# Altium project BRCM_V1.PrjPcb
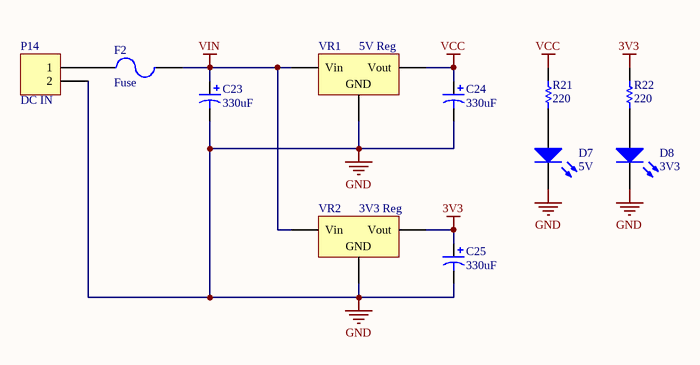
[diagram p0: Votage Reguator.SchDoc]
5 sheets, 84 parts. Net scope: global (net labels, ports and power ports of the same name join across sheets).
Sheets:
  Votage Reguator.SchDoc
  BRCM_V1.SchDoc
  DXL Bus.SchDoc
  IMU Sensor.SchDoc
  USB To Serial.SchDoc

## Sheet Votage Reguator.SchDoc
size A4

### Parts
C23  330uF  [SV-C]
C24  330uF  [SV-C]
C25  330uF  [SV-C]
D7  5V  [CHIPLED_0603]
D8  3V3  [CHIPLED_0603]
F2  Fuse  [FUSE-HOLDER-SMD]
P14  DC IN  [DEANS]
R21  220  [0603-RES]
R22  220  [0603-RES]
VR1  5V Reg  [OKI-78SRH]
VR2  3V3 Reg  [OKI-78SRH]

### Nets
3V3: C25.1 R22.2 VR2.3(Vout)
GND: C23.2 C24.2 C25.2 D7.2(K) D8.2(K) P14.2 VR1.2(GND) VR2.2(GND)
VCC: C24.1 R21.2 VR1.3(Vout)
VIN: C23.1 F2.2 VR1.1(Vin) VR2.1(Vin)
NetD7_1: D7.1(A) R21.1
NetD8_1: D8.1(A) R22.1
NetF2_1: F2.1 P14.1

### Library data of the parts
C23-C25 = Cap Pol: Polarized Capacitor (Axial); Published: 8-Jun-2000; LatestRevisionDate: 17-Jul-2002; LatestRevisionNote: Re-released for DXP Platform.; PackageReference: POLAR0.8; Publisher: Altium Limited; PackageDescription: Polarized Capacitor; 2 Leads; Value: 330uF
D7 D8 = LED: Typical INFRARED GaAs LED; Published: 8-Jun-2000; LatestRevisionDate: 08-Jul-2005; LatestRevisionNote: Mech Layer 1 removed.; PackageReference: LED-0; Publisher: Altium Limited; PackageDescription: LED; 2 Leads
P14 = Header 2: Header, 2-Pin; LatestRevisionDate: 17-Jul-2002; LatestRevisionNote: Re-released for DXP Platform.; Publisher: Altium Limited
R21 R22 = Res: Resistor; Published: 8-Jun-2000; LatestRevisionDate: 17-Jul-2002; LatestRevisionNote: Re-released for DXP Platform.; PackageReference: AXIAL-0.3; Publisher: Altium Limited; PackageDescription: Axial Device, Thru-Hole; 2 Leads; 0.3 in Pin Spacing; Value: 220
VR1 VR2 = Volt Reg: Voltage Regulator; Published: 24-Mar-1999; LatestRevisionDate: 29-May-2009; LatestRevisionNote: IPC-7351 Footprint Added.; PackageReference: D2PAK; Publisher: Altium Limited; PackageDescription: 3-Pin Transistor Outline Package 2.54 mm Pitch, 15.1 mm Lead Span
F2 = Fuse: Published: 8-Jun-2000; LatestRevisionDate: 17-Jul-2002; LatestRevisionNote: Re-released for DXP Platform.; PackageReference: PIN-W2/E2.8; Publisher: Altium Limited; PackageDescription: Thru-Hole; 2 Leads

## Sheet BRCM_V1.SchDoc
size A4
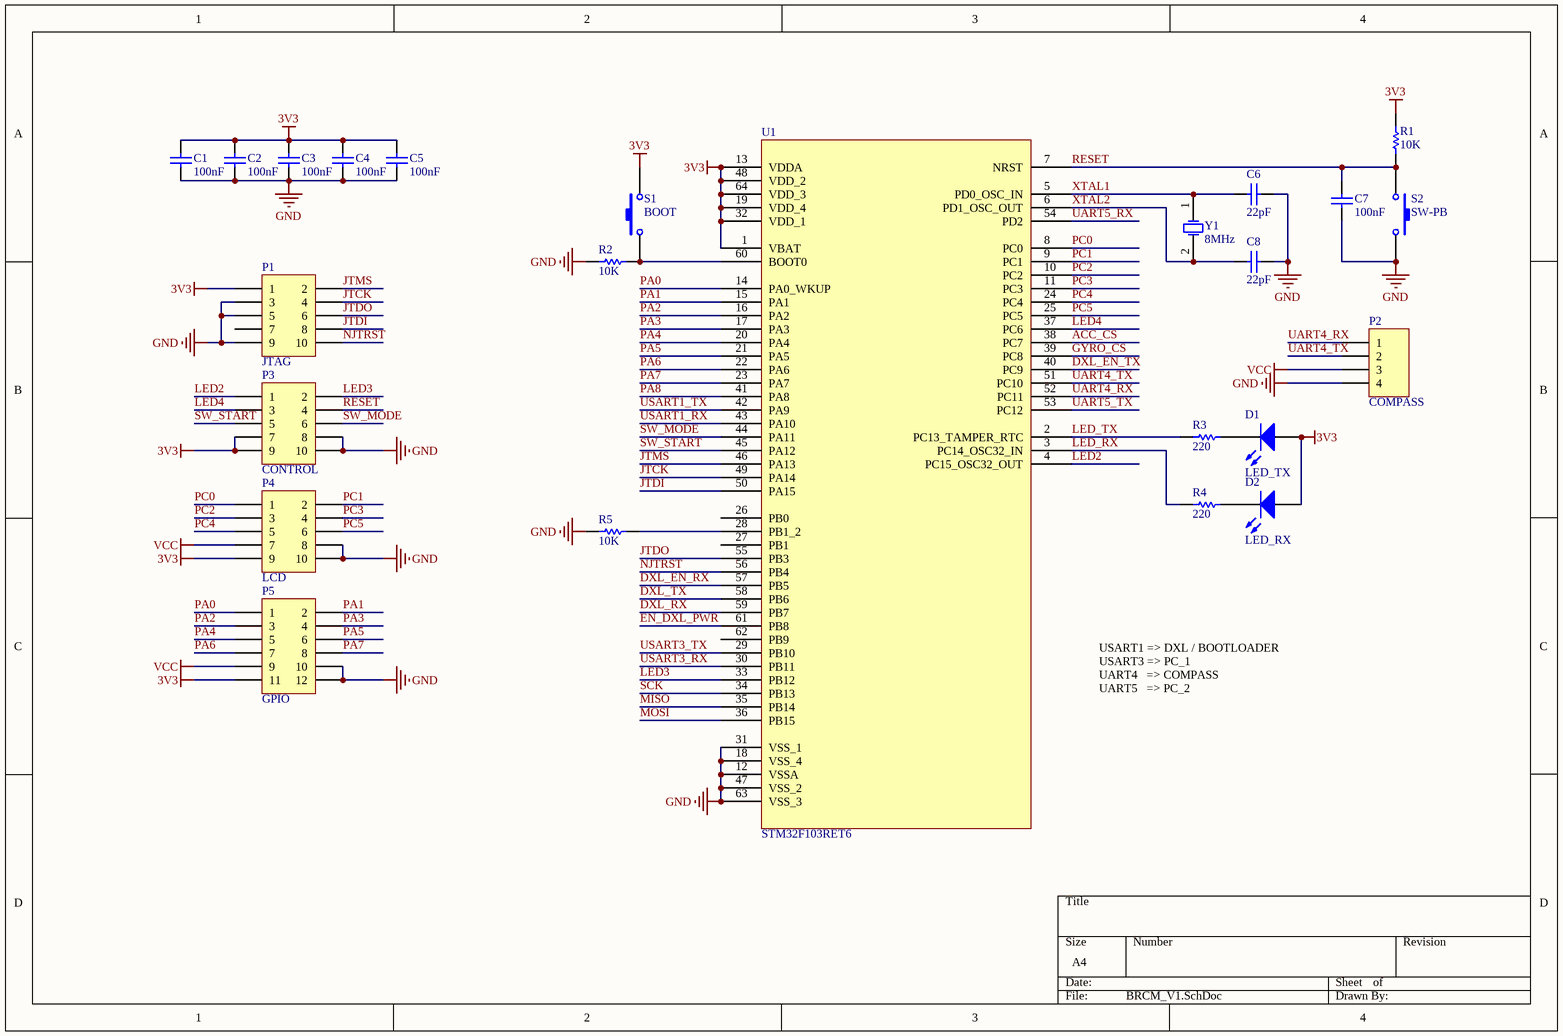
[diagram p1: BRCM_V1.SchDoc]

### Parts
C1  100nF  [0603-CAP]
C2  100nF  [0603-CAP]
C3  100nF  [0603-CAP]
C4  100nF  [0603-CAP]
C5  100nF  [0603-CAP]
C6  22pF  [0603-CAP]
C7  100nF  [0603-CAP]
C8  22pF  [0603-CAP]
D1  LED_TX  [CHIPLED_0603]
D2  LED_RX  [CHIPLED_0603]
P1  JTAG  [HDR2X5]
P2  COMPASS  [HDR1X4]
P3  CONTROL  [HDR2X5]
P4  LCD  [HDR2X5]
P5  GPIO  [HDR2X6]
R1  10K  [0603-RES]
R2  10K  [0603-RES]
R3  220  [0603-RES]
R4  220  [0603-RES]
R5  10K  [0603-RES]
S1  BOOT  [TACTILE-SWITCH-SMD]
S2  SW-PB  [TACTILE-SWITCH-SMD]
U1  STM32F103RET6  [QFP-64N]
Y1  8MHz  [HC49UP]

### Nets
3V3: C1.2 C2.2 C3.2 C4.2 C5.2 D1.1(A) D2.1(A) P1.1 P3.7 P3.9 P4.9 P5.11 R1.2 S1.3 U1.1(VBAT) U1.13(VDDA) U1.19(VDD_4) U1.32(VDD_1) U1.48(VDD_2) U1.64(VDD_3)
GND: C1.1 C2.1 C3.1 C4.1 C5.1 C6.1 C7.1 C8.1 P1.3 P1.5 P1.9 P2.4 P3.8 P3.10 P4.8 P4.10 P5.10 P5.12 R2.1 R5.1 S2.3 U1.12(VSSA) U1.18(VSS_4) U1.31(VSS_1) U1.47(VSS_2) U1.63(VSS_3)
VCC: P2.3 P4.7 P5.9
ACC_CS: U1.38(PC7)
DXL_EN_RX: U1.57(PB5)
DXL_EN_TX: U1.40(PC9)
DXL_RX: U1.59(PB7)
DXL_TX: U1.58(PB6)
EN_DXL_PWR: U1.61(PB8)
GYRO_CS: U1.39(PC8)
JTCK: P1.4 U1.49(PA14)
JTDI: P1.8 U1.50(PA15)
JTDO: P1.6 U1.55(PB3)
JTMS: P1.2 U1.46(PA13)
LED2: P3.1 U1.4(PC15_OSC32_OUT)
LED3: P3.2 U1.33(PB12)
LED4: P3.3 U1.37(PC6)
LED_RX: R4.1 U1.3(PC14_OSC32_IN)
LED_TX: R3.1 U1.2(PC13_TAMPER_RTC)
MISO: U1.35(PB14)
MOSI: U1.36(PB15)
NJTRST: P1.10 U1.56(PB4)
PA0: P5.1 U1.14(PA0_WKUP)
PA1: P5.2 U1.15(PA1)
PA2: P5.3 U1.16(PA2)
PA3: P5.4 U1.17(PA3)
PA4: P5.5 U1.20(PA4)
PA5: P5.6 U1.21(PA5)
PA6: P5.7 U1.22(PA6)
PA7: P5.8 U1.23(PA7)
PA8: U1.41(PA8)
PC0: P4.1 U1.8(PC0)
PC1: P4.2 U1.9(PC1)
PC2: P4.3 U1.10(PC2)
PC3: P4.4 U1.11(PC3)
PC4: P4.5 U1.24(PC4)
PC5: P4.6 U1.25(PC5)
RESET: C7.2 P3.4 R1.1 S2.1 U1.7(NRST)
SCK: U1.34(PB13)
SW_MODE: P3.6 U1.44(PA11)
SW_START: P3.5 U1.45(PA12)
UART4_RX: P2.1 U1.52(PC11)
UART4_TX: P2.2 U1.51(PC10)
UART5_RX: U1.54(PD2)
UART5_TX: U1.53(PC12)
USART1_RX: U1.43(PA10)
USART1_TX: U1.42(PA9)
USART3_RX: U1.30(PB11)
USART3_TX: U1.29(PB10)
XTAL1: C6.2 U1.5(PD0_OSC_IN) Y1.1(OSC1)
XTAL2: C8.2 U1.6(PD1_OSC_OUT) Y1.2(OSC2)
NetD1_2: D1.2(K) R3.2
NetD2_2: D2.2(K) R4.2
NetR2_2: R2.2 S1.1 U1.60(BOOT0)
NetR5_2: R5.2 U1.28(PB1_2)

Not connected (* = marked no-connect by the designer): P1 7; U1 26(PB0) 27(PB1) 62(PB9)

### Notes on the sheet
- USART1 => DXL / BOOTLOADER
  USART3 => PC_1
  UART4   => COMPASS
  UART5   => PC_2

### Library data of the parts
C1-C8 = Cap: Capacitor; Published: 8-Jun-2000; LatestRevisionDate: 17-Jul-2002; LatestRevisionNote: Re-released for DXP Platform.; PackageReference: RAD-0.3; Publisher: Altium Limited; PackageDescription: Radial Cap, Thru-Hole; 2 Leads; 0.3 in Pin Spacing
  C1-C5 C7: Value: 100nF
  C6 C8: Value: 22pF
D1 D2 = LED: Typical INFRARED GaAs LED; Published: 8-Jun-2000; LatestRevisionDate: 08-Jul-2005; LatestRevisionNote: Mech Layer 1 removed.; PackageReference: LED-0; Publisher: Altium Limited; PackageDescription: LED; 2 Leads
P1 P3 P4 = Header 5X2: Header, 5-Pin, Dual row; LatestRevisionDate: 17-Jul-2002; LatestRevisionNote: Re-released for DXP Platform.; Publisher: Altium Limited
P2 = Header 4: Header, 4-Pin; LatestRevisionDate: 17-Jul-2002; LatestRevisionNote: Re-released for DXP Platform.; Publisher: Altium Limited
P5 = Header 6X2: Header, 6-Pin, Dual row; LatestRevisionDate: 17-Jul-2002; LatestRevisionNote: Re-released for DXP Platform.; Publisher: Altium Limited
R1-R5 = Res: Resistor; Published: 8-Jun-2000; LatestRevisionDate: 17-Jul-2002; LatestRevisionNote: Re-released for DXP Platform.; PackageReference: AXIAL-0.3; Publisher: Altium Limited; PackageDescription: Axial Device, Thru-Hole; 2 Leads; 0.3 in Pin Spacing
  R1 R2 R5: Value: 10K
  R3 R4: Value: 220
S1 S2 = SW-PB: Switch; Published: 24-Mar-1999; LatestRevisionDate: 17-Jul-2002; LatestRevisionNote: Re-released for DXP Platform.; PackageReference: SPST-2; Publisher: Altium Limited; PackageDescription: Switch; 2 Leads
Y1 = XTAL: Crystal Oscillator; Published: 8-Jun-2000; LatestRevisionDate: 17-Jul-2002; LatestRevisionNote: Re-released for DXP Platform.; PackageReference: R38; Publisher: Altium Limited; PackageDescription: Crystal, Thru-Hole; 2 Leads; Body 3.1 x 8.2 mm (Dia.xH)
U1 = STM32F103RET6: MPN: STM32F103RET6; OC_FARNELL: 1624138; OC_NEWARK: 01P4101; PACKAGE: QFP-64; SUPPLIER: STMICROELECTRONICS

## Sheet DXL Bus.SchDoc
size A4; DrawnBy: Eko Rudiawan
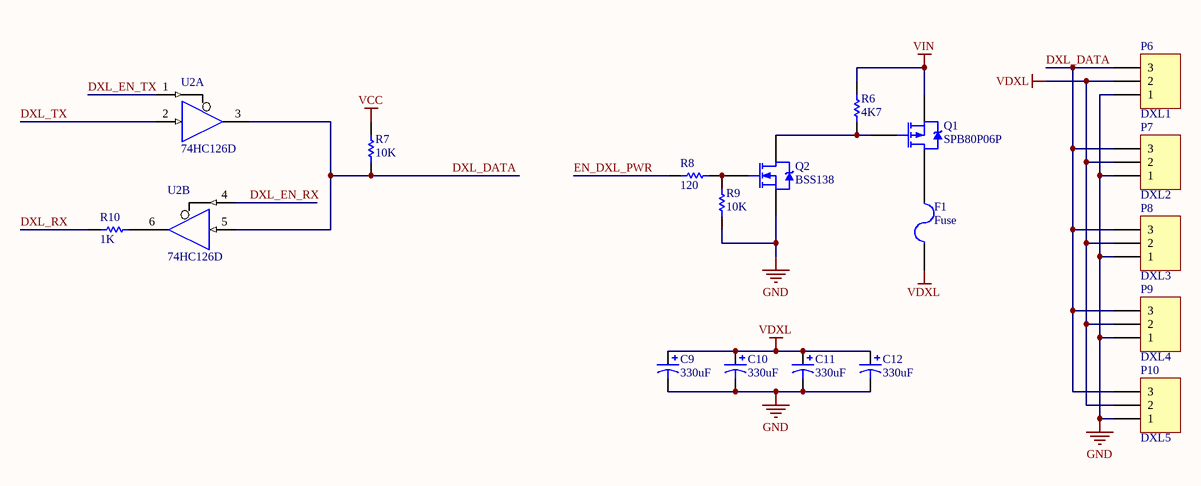
[diagram p2: DXL Bus.SchDoc]

### Parts
C9  330uF  [SV-C]
C10  330uF  [SV-C]
C11  330uF  [SV-C]
C12  330uF  [SV-C]
F1  Fuse  [FUSE-HOLDER-SMD]
P6  DXL1  [DXL]
P7  DXL2  [DXL]
P8  DXL3  [DXL]
P9  DXL4  [DXL]
P10  DXL5  [DXL]
Q1  SPB80P06P  [TO263]
Q2  BSS138  [SOT23]
R6  4K7  [0603-RES]
R7  10K  [0603-RES]
R8  120  [0603-RES]
R9  10K  [0603-RES]
R10  1K  [0603-RES]
U2  74HC126D  [14-SOIC]  (parts A,B of 4)

### Nets
GND: C9.2 C10.2 C11.2 C12.2 P6.1 P7.1 P8.1 P9.1 P10.1 Q2.2(S) R9.1 U2.7(GND)
VCC: R7.2 U2.14(VCC)
VDXL: C9.1 C10.1 C11.1 C12.1 F1.1 P6.2 P7.2 P8.2 P9.2 P10.2
VIN: Q1.3(S) R6.2
DXL_DATA: P6.3 P7.3 P8.3 P9.3 P10.3 R7.1 U2.3(Y) U2.5(A)
DXL_EN_RX: U2.4(OE)
DXL_EN_TX: U2.1(OE)
DXL_RX: R10.1
DXL_TX: U2.2(A)
EN_DXL_PWR: R8.1
NetF1_2: F1.2 Q1.2(D)
NetQ1_1: Q1.1(G) Q2.3(D) R6.1
NetQ2_1: Q2.1(G) R8.2 R9.2
NetR10_2: R10.2 U2.6(Y)

### Library data of the parts
C9-C12 = Cap Pol: Polarized Capacitor (Axial); Published: 8-Jun-2000; LatestRevisionDate: 17-Jul-2002; LatestRevisionNote: Re-released for DXP Platform.; PackageReference: POLAR0.8; Publisher: Altium Limited; PackageDescription: Polarized Capacitor; 2 Leads; Value: 330uF
P6-P10 = Header 3: Header, 3-Pin; LatestRevisionDate: 17-Jul-2002; LatestRevisionNote: Re-released for DXP Platform.; Publisher: Altium Limited
Q1 = PMOS: P-Channel Power MOSFET; Note: Pin 4 not drawn and electrically connected to Pin 2.; Published: 8-Jun-2000; LatestRevisionDate: 17-Jul-2002; LatestRevisionNote: Re-released for DXP Platform.; DatasheetVersion: PD-9.390D; PackageVersion: Feb-1997; PackageReference: TO-220AB; Publisher: Altium Limited; PackageDescription: TO, Thru-Hole, Vertical, Heatsink Mounted; 3 In-Line Leads; Pitch 2.54 mm; ComponentLink1Description: Manufacturer Link; ComponentLink1URL: http://www.irf.com/
Q2 = NMOS: N-Channel Power MOSFET; Note: Pin 2 is electrically connected to pin 4.; Published: 8-Jun-2000; LatestRevisionDate: 17-Jul-2002; LatestRevisionNote: Re-released for DXP Platform.; DatasheetVersion: PD-9.814; PackageVersion: Feb-1997; PackageReference: TO-220AB; Publisher: Altium Limited; PackageDescription: TO, Thru-Hole, Vertical, Heatsink Mounted; 3 In-Line Leads; Pitch 2.54 mm; ComponentLink1Description: Manufacturer Link; ComponentLink1URL: http://www.irf.com/
R6-R10 = Res: Resistor; Published: 8-Jun-2000; LatestRevisionDate: 17-Jul-2002; LatestRevisionNote: Re-released for DXP Platform.; PackageReference: AXIAL-0.3; Publisher: Altium Limited; PackageDescription: Axial Device, Thru-Hole; 2 Leads; 0.3 in Pin Spacing
  R6: Value: 4K7
  R7 R9: Value: 10K
  R8: Value: 120
  R10: Value: 1K
U2 = 74HC126D: Quadruple Bus Buffer Gate with 3-State Outputs; Published: 8-Jun-2000; LatestRevisionDate: 13-Apr-2006; LatestRevisionNote: IPC-7351 Footprint Added.; DatasheetVersion: Oct-1998; PackageVersion: Jan-1998; PackageReference: D014; Publisher: Altium Limited; PackageDescription: 14-Pin Small Outline Integrated Circuit 1.27 mm Pitch; Code_IPC: SOIC127P600-14; ComponentLink1Description: Manufacturer Link; ComponentLink1URL: http://www.ti.com/; ComponentLink2Description: Datasheet; ComponentLink2URL: http://www-s.ti.com/sc/ds/sn74ahct126.pdf
F1 = Fuse: Published: 8-Jun-2000; LatestRevisionDate: 17-Jul-2002; LatestRevisionNote: Re-released for DXP Platform.; PackageReference: PIN-W2/E2.8; Publisher: Altium Limited; PackageDescription: Thru-Hole; 2 Leads

## Sheet IMU Sensor.SchDoc
size A4
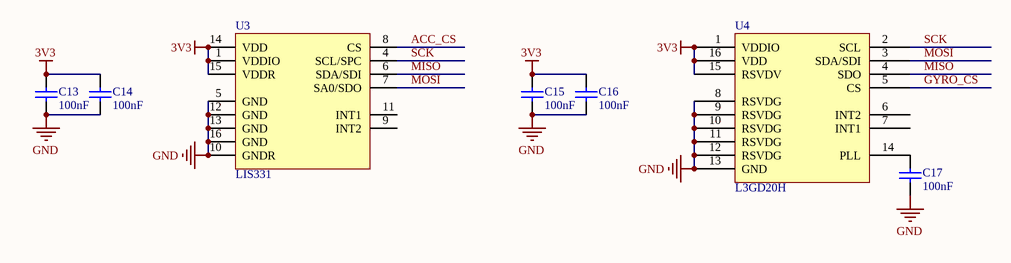
[diagram p3: IMU Sensor.SchDoc]

### Parts
C13  100nF  [0603-CAP]
C14  100nF  [0603-CAP]
C15  100nF  [0603-CAP]
C16  100nF  [0603-CAP]
C17  100nF  [0603-CAP]
U3  LIS331  [LGA16-3MM]
U4  L3GD20H  [LGA16-3MM]

### Nets
3V3: C13.2 C14.2 C15.2 C16.2 U3.1(VDDIO) U3.14(VDD) U3.15(VDDR) U4.1(VDDIO) U4.15(RSVDV) U4.16(VDD)
GND: C13.1 C14.1 C15.1 C16.1 C17.1 U3.5(GND) U3.10(GNDR) U3.12(GND) U3.13(GND) U3.16(GND) U4.8(RSVDG) U4.9(RSVDG) U4.10(RSVDG) U4.11(RSVDG) U4.12(RSVDG) U4.13(GND)
ACC_CS: U3.8(CS)
GYRO_CS: U4.5(CS)
MISO: U3.6(SDA/SDI) U4.4(SDO)
MOSI: U3.7(SA0/SDO) U4.3(SDA/SDI)
SCK: U3.4(SCL/SPC) U4.2(SCL)
NetC17_2: C17.2 U4.14(PLL)

Not connected (* = marked no-connect by the designer): U3 9(INT2) 11(INT1); U4 6(INT2) 7(INT1)

### Library data of the parts
C13-C17 = Cap: Capacitor; Published: 8-Jun-2000; LatestRevisionDate: 17-Jul-2002; LatestRevisionNote: Re-released for DXP Platform.; PackageReference: RAD-0.3; Publisher: Altium Limited; PackageDescription: Radial Cap, Thru-Hole; 2 Leads; 0.3 in Pin Spacing; Value: 100nF

## Sheet USB To Serial.SchDoc
size A4
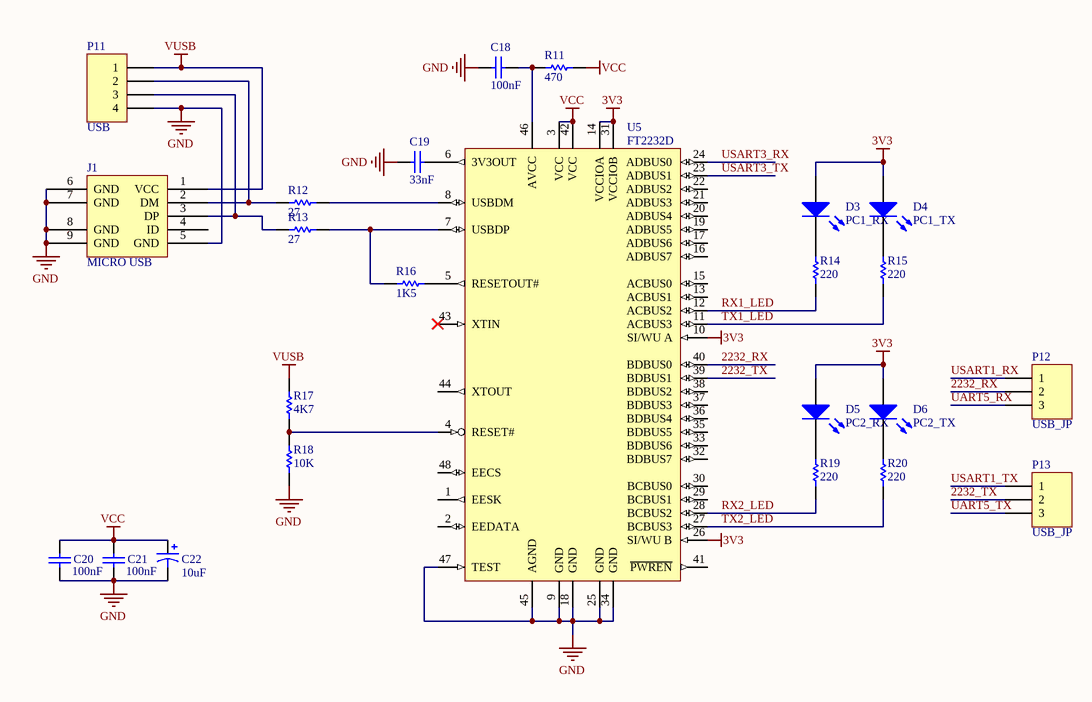
[diagram p4: USB To Serial.SchDoc]

### Parts
C18  100nF  [0603-CAP]
C19  33nF  [0603-CAP]
C20  100nF  [0603-CAP]
C21  100nF  [0603-CAP]
C22  10uF  [SV-C]
D3  PC1_RX  [CHIPLED_0603]
D4  PC1_TX  [CHIPLED_0603]
D5  PC2_RX  [CHIPLED_0603]
D6  PC2_TX  [CHIPLED_0603]
J1  MICRO USB  [USB_MICRO]
P11  USB  [HDR1X4]
P12  USB_JP  [HDR1X3]
P13  USB_JP  [HDR1X3]
R11  470  [0603-RES]
R12  27  [0603-RES]
R13  27  [0603-RES]
R14  220  [0603-RES]
R15  220  [0603-RES]
R16  1K5  [0603-RES]
R17  4K7  [0603-RES]
R18  10K  [0603-RES]
R19  220  [0603-RES]
R20  220  [0603-RES]
U5  FT2232D  [QFP-48N]

### Nets
3V3: D3.1(A) D4.1(A) D5.1(A) D6.1(A) U5.10(SI/WU_A) U5.14(VCCIOA) U5.26(SI/WU_B) U5.31(VCCIOB)
GND: C18.1 C19.1 C20.1 C21.1 C22.2 J1.5(GND) J1.6(GND) J1.7(GND) J1.8(GND) J1.9(GND) P11.4 R18.1 U5.9(GND) U5.18(GND) U5.25(GND) U5.34(GND) U5.45(AGND) U5.47(TEST)
VCC: C20.2 C21.2 C22.1 R11.2 U5.3(VCC) U5.42(VCC)
VUSB: J1.1(VCC) P11.1 R17.2
2232_RX: P12.2 U5.40(BDBUS0)
2232_TX: P13.2 U5.39(BDBUS1)
RX1_LED: R14.1 U5.12(ACBUS2)
RX2_LED: R19.1 U5.28(BCBUS2)
TX1_LED: R15.1 U5.11(ACBUS3)
TX2_LED: R20.1 U5.27(BCBUS3)
UART5_RX: P12.3
UART5_TX: P13.3
USART1_RX: P12.1
USART1_TX: P13.1
USART3_RX: U5.24(ADBUS0)
USART3_TX: U5.23(ADBUS1)
NetC18_2: C18.2 R11.1 U5.46(AVCC)
NetC19_2: C19.2 U5.6(3V3OUT)
NetD3_2: D3.2(K) R14.2
NetD4_2: D4.2(K) R15.2
NetD5_2: D5.2(K) R19.2
NetD6_2: D6.2(K) R20.2
NetJ1_2: J1.2(DM) P11.2 R12.1
NetJ1_3: J1.3(DP) P11.3 R13.1
NetR12_2: R12.2 U5.8(USBDM)
NetR13_2: R13.2 R16.1 U5.7(USBDP)
NetR16_2: R16.2 U5.5(RESETOUT#)
NetR17_1: R17.1 R18.2 U5.4(RESET#)

Not connected (* = marked no-connect by the designer): J1 4(ID); U5 1(EESK) 2(EEDATA) 13(ACBUS1) 15(ACBUS0) 16(ADBUS7) 17(ADBUS6) 19(ADBUS5) 20(ADBUS4) 21(ADBUS3) 22(ADBUS2) 29(BCBUS1) 30(BCBUS0) 32(BDBUS7) 33(BDBUS6) 35(BDBUS5) 36(BDBUS4) 37(BDBUS3) 38(BDBUS2) 41(~{PWREN}) 43(XTIN)* 44(XTOUT) 48(EECS)

### Library data of the parts
C18-C21 = Cap: Capacitor; Published: 8-Jun-2000; LatestRevisionDate: 17-Jul-2002; LatestRevisionNote: Re-released for DXP Platform.; PackageReference: RAD-0.3; Publisher: Altium Limited; PackageDescription: Radial Cap, Thru-Hole; 2 Leads; 0.3 in Pin Spacing
  C18 C20 C21: Value: 100nF
  C19: Value: 33nF
C22 = Cap Pol: Polarized Capacitor (Axial); Published: 8-Jun-2000; LatestRevisionDate: 17-Jul-2002; LatestRevisionNote: Re-released for DXP Platform.; PackageReference: POLAR0.8; Publisher: Altium Limited; PackageDescription: Polarized Capacitor; 2 Leads; Value: 10uF
D3-D6 = LED: Typical INFRARED GaAs LED; Published: 8-Jun-2000; LatestRevisionDate: 08-Jul-2005; LatestRevisionNote: Mech Layer 1 removed.; PackageReference: LED-0; Publisher: Altium Limited; PackageDescription: LED; 2 Leads
P11 = Header 4: Header, 4-Pin; LatestRevisionDate: 17-Jul-2002; LatestRevisionNote: Re-released for DXP Platform.; Publisher: Altium Limited
P12 P13 = Header 3: Header, 3-Pin; LatestRevisionDate: 17-Jul-2002; LatestRevisionNote: Re-released for DXP Platform.; Publisher: Altium Limited
R11-R20 = Res: Resistor; Published: 8-Jun-2000; LatestRevisionDate: 17-Jul-2002; LatestRevisionNote: Re-released for DXP Platform.; PackageReference: AXIAL-0.3; Publisher: Altium Limited; PackageDescription: Axial Device, Thru-Hole; 2 Leads; 0.3 in Pin Spacing
  R11: Value: 470
  R12 R13: Value: 27
  R14 R15 R19 R20: Value: 220
  R16: Value: 1K5
  R17: Value: 4K7
  R18: Value: 10K
U5 = FT2232D: Dual USB UART/FIFO Chip, LQFP-48; Published: 19-Aug-2010; DatasheetVersion: ver 2.03, May-2010; PackageVersion: 2005; PackageReference: LQFP-48; Publisher: Altium Limited; PackageDescription: 48-Pin Thin Quad Flat Pack 0.5 mm Pitch; ComponentLink1Description: Manufacturer Link; ComponentLink1URL: http://www.ftdichip.com/Products/ICs/FT2232D.htm; ComponentLink2Description: Datasheet; ComponentLink2URL: http://www.ftdichip.com/Support/Documents/DataSheets/ICs/DS_FT2232D.pdf

## Nets that join several sheets
3V3: Votage Reguator (C25.1 R22.2 VR2.3), BRCM_V1 (20 pins), IMU Sensor (10 pins), USB To Serial (8 pins)
GND: Votage Reguator (8 pins), BRCM_V1 (26 pins), DXL Bus (12 pins), IMU Sensor (16 pins), USB To Serial (18 pins)
VCC: Votage Reguator (C24.1 R21.2 VR1.3), BRCM_V1 (P2.3 P4.7 P5.9), DXL Bus (R7.2 U2.14), USB To Serial (6 pins)
VIN: Votage Reguator (C23.1 F2.2 VR1.1 VR2.1), DXL Bus (Q1.3 R6.2)
ACC_CS: BRCM_V1 (U1.38), IMU Sensor (U3.8)
DXL_EN_RX: BRCM_V1 (U1.57), DXL Bus (U2.4)
DXL_EN_TX: BRCM_V1 (U1.40), DXL Bus (U2.1)
DXL_RX: BRCM_V1 (U1.59), DXL Bus (R10.1)
DXL_TX: BRCM_V1 (U1.58), DXL Bus (U2.2)
EN_DXL_PWR: BRCM_V1 (U1.61), DXL Bus (R8.1)
GYRO_CS: BRCM_V1 (U1.39), IMU Sensor (U4.5)
MISO: BRCM_V1 (U1.35), IMU Sensor (U3.6 U4.4)
MOSI: BRCM_V1 (U1.36), IMU Sensor (U3.7 U4.3)
SCK: BRCM_V1 (U1.34), IMU Sensor (U3.4 U4.2)
UART5_RX: BRCM_V1 (U1.54), USB To Serial (P12.3)
UART5_TX: BRCM_V1 (U1.53), USB To Serial (P13.3)
USART1_RX: BRCM_V1 (U1.43), USB To Serial (P12.1)
USART1_TX: BRCM_V1 (U1.42), USB To Serial (P13.1)
USART3_RX: BRCM_V1 (U1.30), USB To Serial (U5.24)
USART3_TX: BRCM_V1 (U1.29), USB To Serial (U5.23)